# EAGLE design reloj6 (EAGLE 7.6.0)
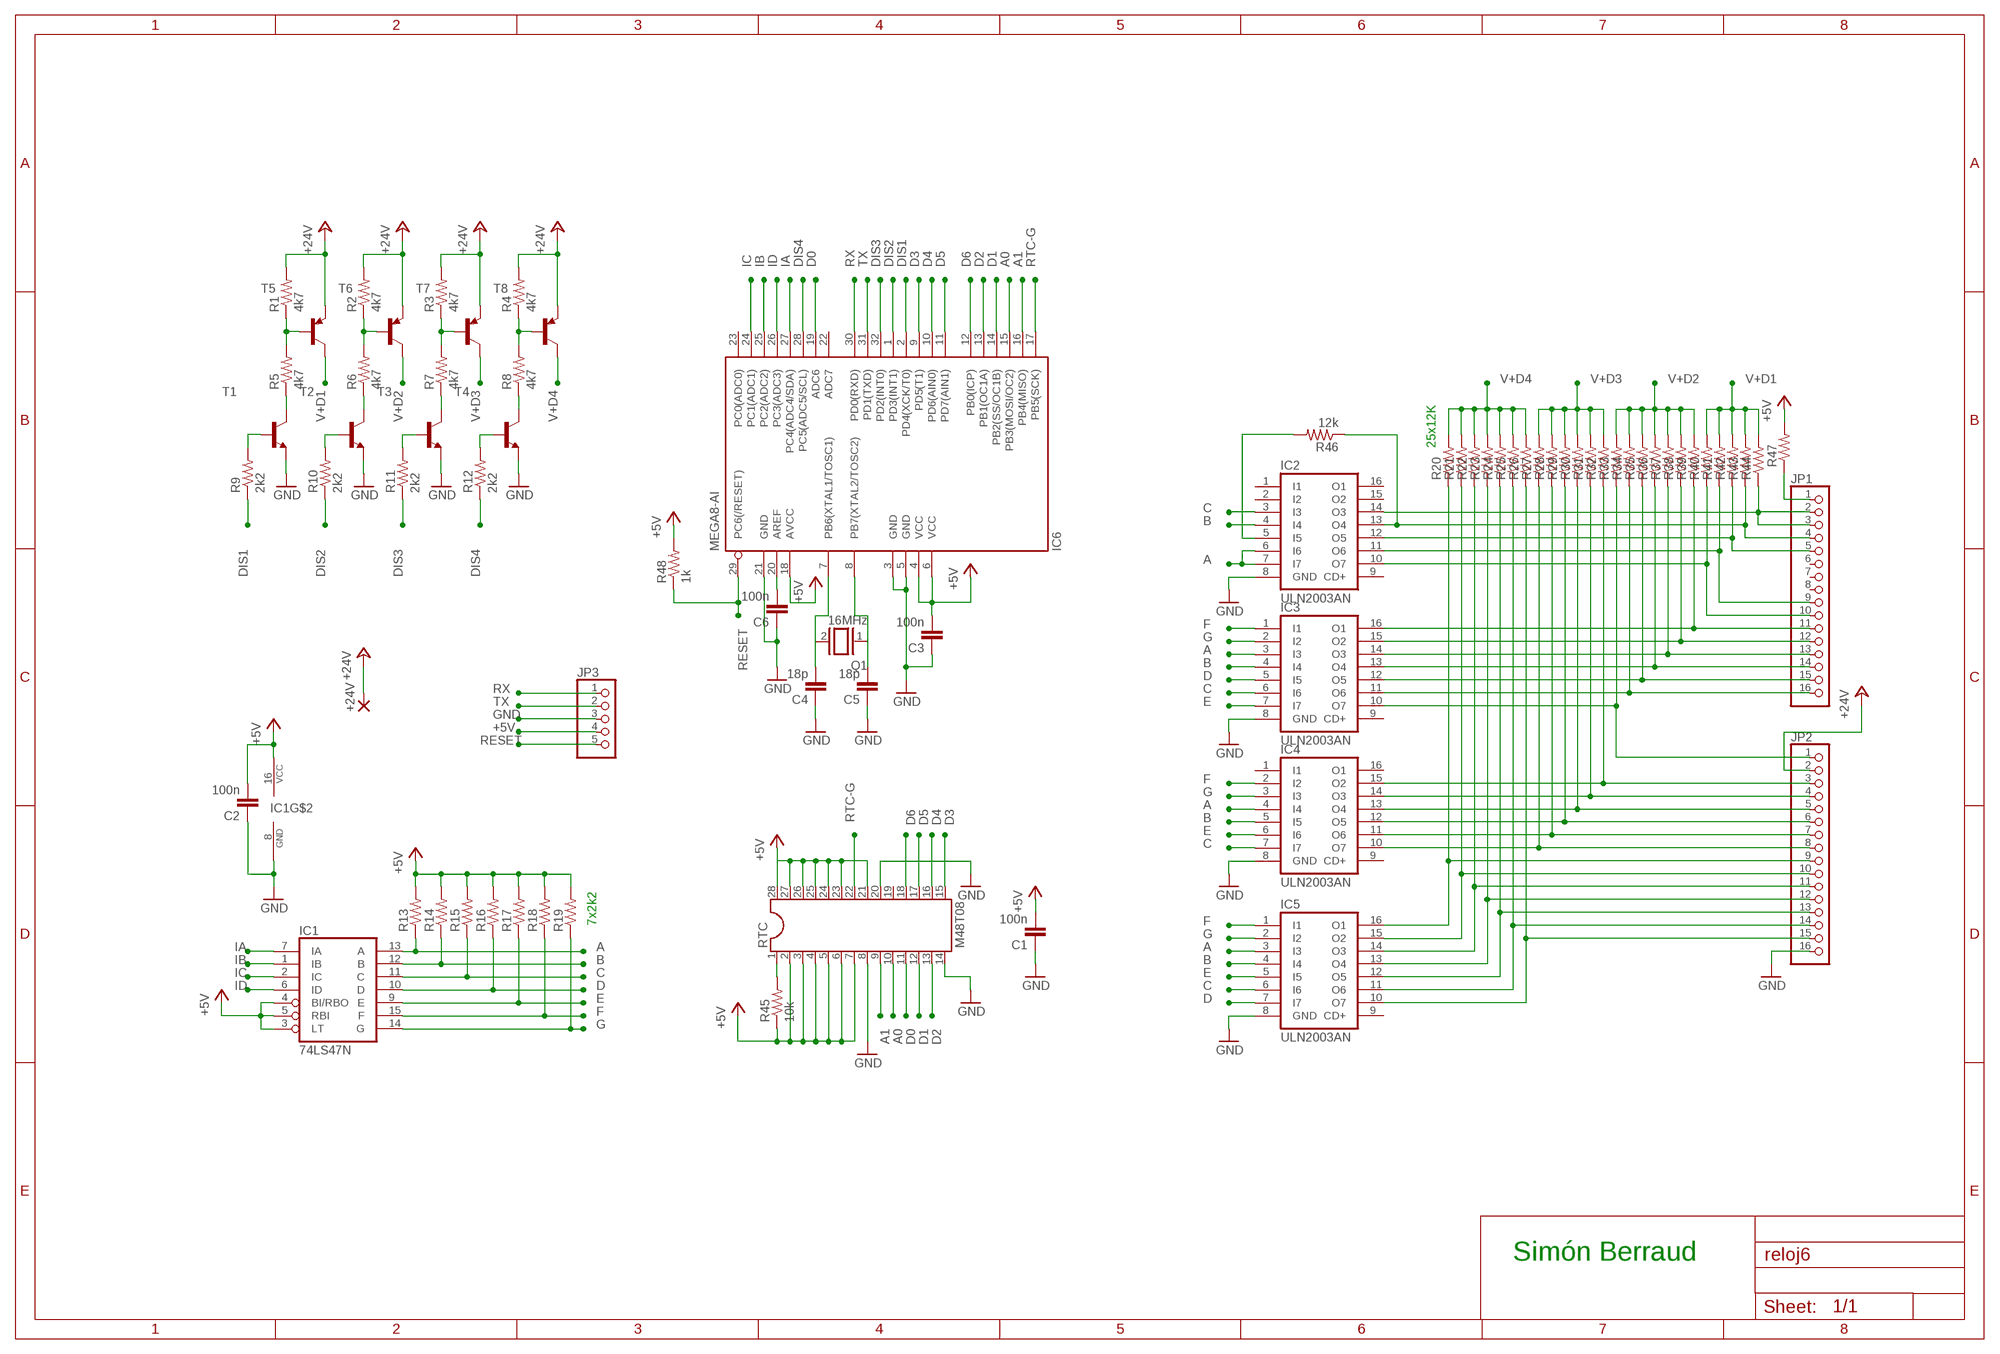
[diagram p0: schematic, sheet 1]

## Parts
+24V  2,54/0,8  [2,54/0,8]
C1  100n  C-EU025-025X050  [C025-025X050]
C2  100n  C-EU025-025X050  [C025-025X050]
C3  100n  C-EU025-025X050  [C025-025X050]
C4  18p  C-EUC0805K  [C0805K]
C5  18p  C-EUC0805K  [C0805K]
C6  100n  C-EUC0805K  [C0805K]
IC1  74LS47N  [DIL16]
IC2  ULN2003AN  [DIL16]
IC3  ULN2003AN  [DIL16]
IC4  ULN2003AN  [DIL16]
IC5  ULN2003AN  [DIL16]
IC6  MEGA8-AI  [TQFP32-08]
JP1  PINHD-1X16  [1X16]
JP2  PINHD-1X16  [1X16]
JP3  PINHD-1X5  [1X05]
Q1  16MHz  XTAL/S  [QS]
R1  4k7  R-US_0207/7  [0207/7]
R2  4k7  R-US_0207/7  [0207/7]
R3  4k7  R-US_0207/7  [0207/7]
R4  4k7  R-US_0207/7  [0207/7]
R5  4k7  R-US_0207/7  [0207/7]
R6  4k7  R-US_0207/7  [0207/7]
R7  4k7  R-US_0207/7  [0207/7]
R8  4k7  R-US_0207/7  [0207/7]
R9  2k2  R-US_0207/7  [0207/7]
R10  2k2  R-US_0207/7  [0207/7]
R11  2k2  R-US_0207/7  [0207/7]
R12  2k2  R-US_0207/7  [0207/7]
R13  R-US_0207/7  [0207/7]
R14  R-US_0207/7  [0207/7]
R15  R-US_0207/7  [0207/7]
R16  R-US_0207/7  [0207/7]
R17  R-US_0207/7  [0207/7]
R18  R-US_0207/7  [0207/7]
R19  R-US_0207/7  [0207/7]
R20  R-US_0207/7  [0207/7]
R21  R-US_0207/7  [0207/7]
R22  R-US_0207/7  [0207/7]
R23  R-US_0207/7  [0207/7]
R24  R-US_0207/7  [0207/7]
R25  R-US_0207/7  [0207/7]
R26  R-US_0207/7  [0207/7]
R27  R-US_0207/7  [0207/7]
R28  R-US_0207/7  [0207/7]
R29  R-US_0207/7  [0207/7]
R30  R-US_0207/7  [0207/7]
R31  R-US_0207/7  [0207/7]
R32  R-US_0207/7  [0207/7]
R33  R-US_0207/7  [0207/7]
R34  R-US_0207/7  [0207/7]
R35  R-US_0207/7  [0207/7]
R36  R-US_0207/7  [0207/7]
R37  R-US_0207/7  [0207/7]
R38  R-US_0207/7  [0207/7]
R39  R-US_0207/7  [0207/7]
R40  R-US_0207/7  [0207/7]
R41  R-US_0207/7  [0207/7]
R42  R-US_0207/7  [0207/7]
R43  R-US_0207/7  [0207/7]
R44  R-US_0207/7  [0207/7]
R45  10k  R-US_0207/7  [0207/7]
R46  12k  R-US_0207/7  [0207/7]
R47  R-US_0411/12  [0411/12]
R48  1k  R-US_R1206  [R1206]
RTC  M48T08  DIL28  [DIL28-6]
T1  BC169-NPN-TO92-ECB  [TO92-ECB]
T2  BC169-NPN-TO92-ECB  [TO92-ECB]
T3  BC169-NPN-TO92-ECB  [TO92-ECB]
T4  BC169-NPN-TO92-ECB  [TO92-ECB]
T5  -PNP-TO92-ECB  [TO92-ECB]
T6  -PNP-TO92-ECB  [TO92-ECB]
T7  -PNP-TO92-ECB  [TO92-ECB]
T8  -PNP-TO92-ECB  [TO92-ECB]

## Nets
+5V: C1.2 C2.2 C3.2 IC1.3(LT) IC1.4(BI/RBO) IC1.5(RBI) IC1.16(VCC) IC6.4(VCC) IC6.6(VCC) IC6.18(AVCC) JP3.4 R13.2 R14.2 R15.2 R16.2 R17.2 R18.2 R19.2 R45.1 R47.2 R48.2 RTC.2 RTC.3 RTC.4 RTC.5 RTC.6 RTC.7 RTC.21 RTC.23 RTC.24 RTC.25 RTC.26 RTC.27 RTC.28
+24V: +24V.1(P) JP2.2 R1.2 R2.2 R3.2 R4.2 T5.E T6.E T7.E T8.E
A: IC1.13(A) IC2.6(I6) IC2.7(I7) IC3.3(I3) IC4.4(I4) IC5.3(I3) R13.1
A0: IC6.15(PB3(MOSI/OC2)) RTC.10
A1: IC6.16(PB4(MISO)) RTC.9
B: IC1.12(B) IC2.4(I4) IC3.4(I4) IC4.5(I5) IC5.4(I4) R14.1
C: IC1.11(C) IC2.3(I3) IC3.6(I6) IC4.7(I7) IC5.6(I6) R15.1
D: IC1.10(D) IC3.5(I5) IC5.7(I7) R16.1
D0: IC6.19(ADC6) RTC.11
D1: IC6.14(PB2(SS/OC1B)) RTC.12
D2: IC6.13(PB1(OC1A)) RTC.13
D3: IC6.9(PD5(T1)) RTC.15
D4: IC6.10(PD6(AIN0)) RTC.16
D5: IC6.11(PD7(AIN1)) RTC.17
D6: IC6.12(PB0(ICP)) RTC.18
DIS1: IC6.2(PD4(XCK/T0)) R9.1
DIS2: IC6.1(PD3(INT1)) R10.1
DIS3: IC6.32(PD2(INT0)) R11.1
DIS4: IC6.28(PC5(ADC5/SCL)) R12.1
E: IC1.9(E) IC3.7(I7) IC4.6(I6) IC5.5(I5) R17.1
F: IC1.15(F) IC3.1(I1) IC4.2(I2) IC5.1(I1) R18.1
G: IC1.14(G) IC3.2(I2) IC4.3(I3) IC5.2(I2) R19.1
GND: C1.1 C2.1 C3.1 C4.1 C5.1 C6.1 IC1.8(GND) IC2.8(GND) IC3.8(GND) IC4.8(GND) IC5.8(GND) IC6.3(GND) IC6.5(GND) IC6.21(GND) JP2.16 JP3.3 RTC.8 RTC.14 RTC.20 T1.E T2.E T3.E T4.E
IA: IC1.7(IA) IC6.27(PC4(ADC4/SDA))
IB: IC1.1(IB) IC6.25(PC2(ADC2))
IC: IC1.2(IC) IC6.24(PC1(ADC1))
ID: IC1.6(ID) IC6.26(PC3(ADC3))
N$1: R9.2 T1.B
N$2: R10.2 T2.B
N$3: R11.2 T3.B
N$4: R12.2 T4.B
N$5: JP1.1 R47.1
N$6: R1.1 R5.2 T5.B
N$7: R2.1 R6.2 T6.B
N$8: R3.1 R7.2 T7.B
N$9: R4.1 R8.2 T8.B
N$10: R5.1 T1.C
N$11: R6.1 T2.C
N$12: R45.2 RTC.1
N$13: R7.1 T3.C
N$14: R8.1 T4.C
N$15: C4.2 IC6.7(PB6(XTAL1/TOSC1)) Q1.2
N$16: IC5.16(O1) JP2.9 R20.1
N$17: C5.2 IC6.8(PB7(XTAL2/TOSC2)) Q1.1
N$18: C6.2 IC6.20(AREF)
N$24: IC3.13(O4) JP1.14 R36.1
N$26: IC3.11(O6) JP1.16 R34.1
N$29: IC4.14(O3) JP2.4 R31.1
N$31: IC4.12(O5) JP2.6 R29.1
N$32: IC4.11(O6) JP2.7 R28.1
N$37: IC2.13(O4) JP1.4 R43.1 R46.1
N$38: IC2.5(I5) R46.2
N$39: IC2.10(O7) JP1.10 R40.1
N$40: IC2.11(O6) JP1.9 R41.1
N$41: IC2.12(O5) JP1.5 R42.1
N$42: IC2.14(O3) JP1.2 JP1.3 R44.1
N$43: IC3.16(O1) JP1.11 R39.1
N$44: IC3.15(O2) JP1.12 R38.1
N$45: IC3.14(O3) JP1.13 R37.1
N$47: IC3.12(O5) JP1.15 R35.1
N$49: IC3.10(O7) JP2.1 R33.1
N$50: IC4.15(O2) JP2.3 R32.1
N$52: IC4.13(O4) JP2.5 R30.1
N$55: IC4.10(O7) JP2.8 R27.1
N$57: IC5.15(O2) JP2.10 R21.1
N$58: IC5.14(O3) JP2.11 R22.1
N$59: IC5.13(O4) JP2.12 R23.1
N$60: IC5.12(O5) JP2.13 R24.1
N$61: IC5.11(O6) JP2.14 R25.1
N$62: IC5.10(O7) JP2.15 R26.1
RESET: IC6.29(PC6(/RESET)) JP3.5 R48.1
RTC-G: IC6.17(PB5(SCK)) RTC.22
RX: IC6.30(PD0(RXD)) JP3.1
TX: IC6.31(PD1(TXD)) JP3.2
V+D1: R40.2 R41.2 R42.2 R43.2 R44.2 T5.C
V+D2: R33.2 R34.2 R35.2 R36.2 R37.2 R38.2 R39.2 T6.C
V+D3: R27.2 R28.2 R29.2 R30.2 R31.2 R32.2 T7.C
V+D4: R20.2 R21.2 R22.2 R23.2 R24.2 R25.2 R26.2 T8.C
Unconnected: IC2.1(I1) IC2.2(I2) IC2.9(CD+) IC2.15(O2) IC2.16(O1) IC3.9(CD+) IC4.1(I1) IC4.9(CD+) IC4.16(O1) IC5.9(CD+) IC6.22(ADC7) IC6.23(PC0(ADC0)) JP1.6 JP1.7 JP1.8 RTC.19

## Notes on the sheet
- 25x12K
- 7x2k2
- Simón Berraud

## Library data of the parts
+24V = wirepad:2,54/0,8: THROUGH-HOLE PAD
C1-C3 = rcl:C-EU: CAPACITOR, European symbol
C4-C6 = resistor:C-EU: CAPACITOR, European symbol
IC1 = 74xx-us:74*47: BCD to seven segment DECODER/DRIVER Source: http://www.ee.washington.edu/stores/DataSheets/74ls/74ls47.pdf
IC2-IC5 = uln-udn:ULN2003A: DRIVER ARRAY
IC6 = atmel:MEGA8: MICROCONTROLLER 8 Kbytes FLASH, 1 kbytes SRAM, 512 bytes EEPROM, USART, 6-channel 10 bit ADC, 2-channel 8 bit ADC Pin compatible with Atmega48, ATMega88, ATMega168 Source: avr.lbr; MPN: ATMEGA8-16AU; OC_FARNELL: 9171371; OC_NEWARK: 73M8863
JP1 JP2 = pinhead:PINHD-1X16: PIN HEADER
JP3 = pinhead:PINHD-1X5: PIN HEADER
Q1 = special:XTAL/S: CRYSTAL
R1-R48 = rcl:R-US_: RESISTOR, American symbol
RTC = ic-package:DIL28: Dual In Line
T1-T4 = transistor:*-NPN-: NPN Transistror BF959 corrected 2008.03.06
T5-T8 = transistor-neu-to92:*-PNP-: PNP Transistror

## Board
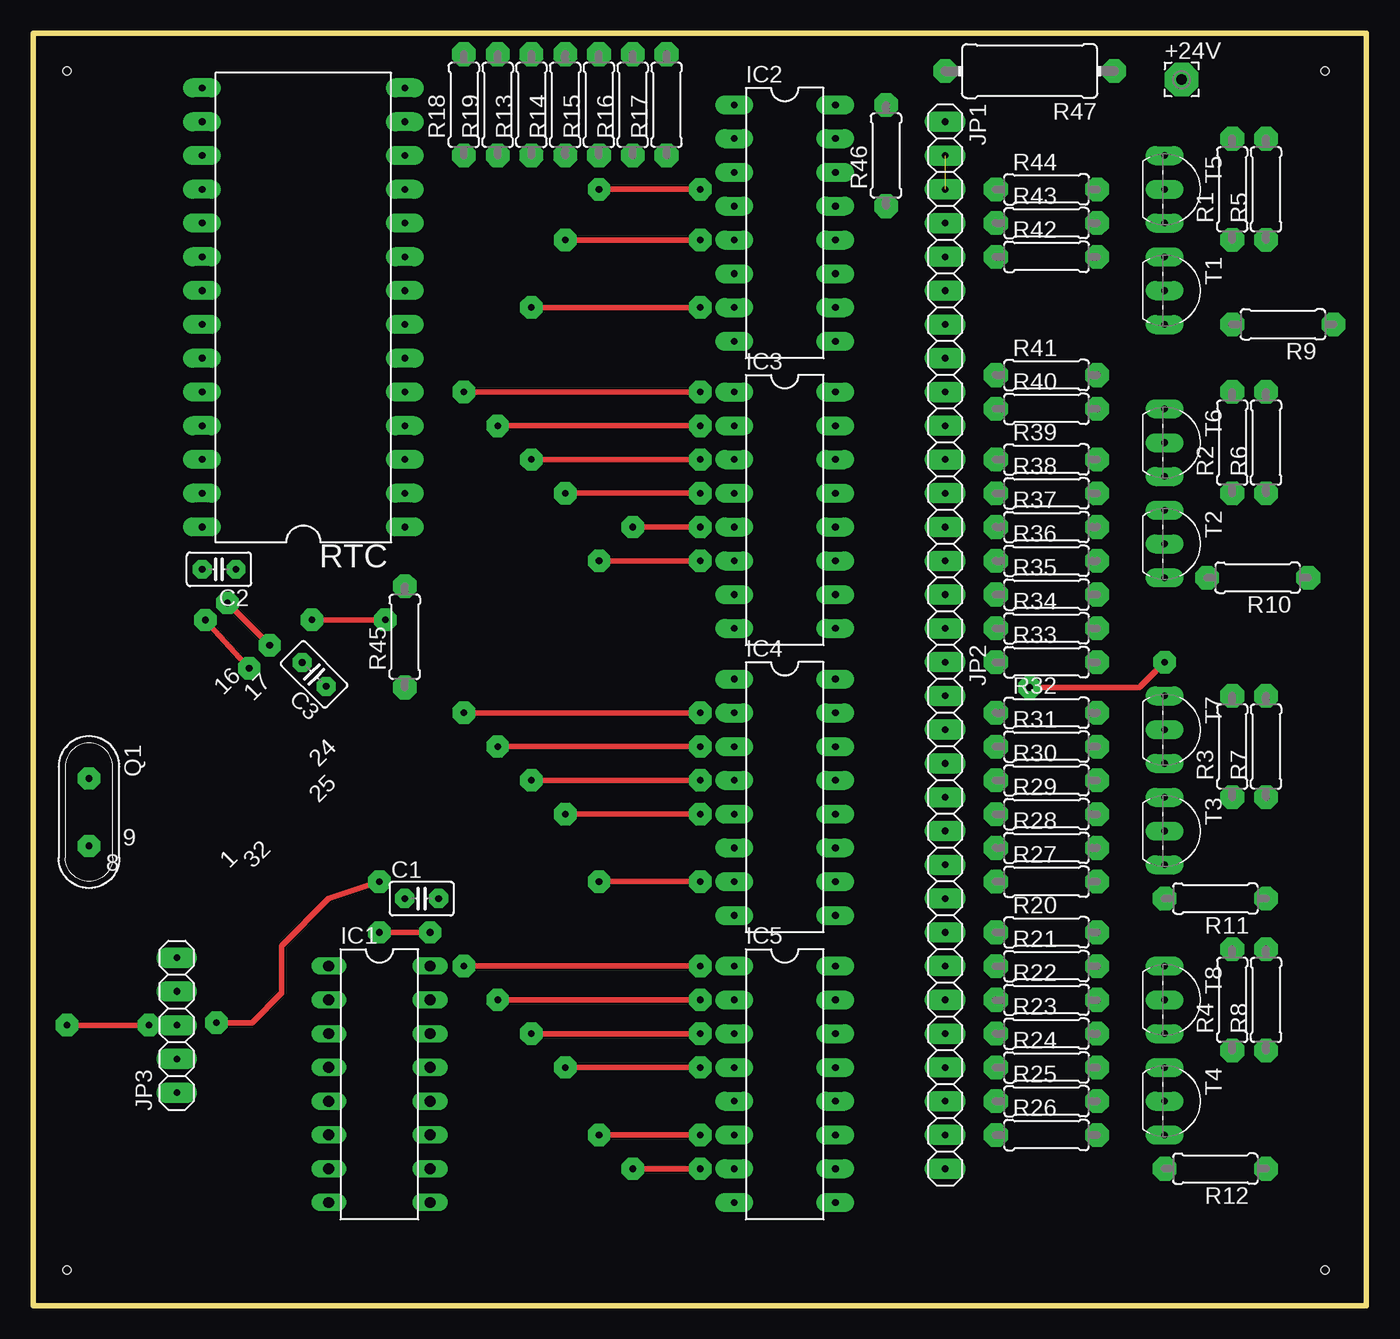
[diagram p1: board, top side]
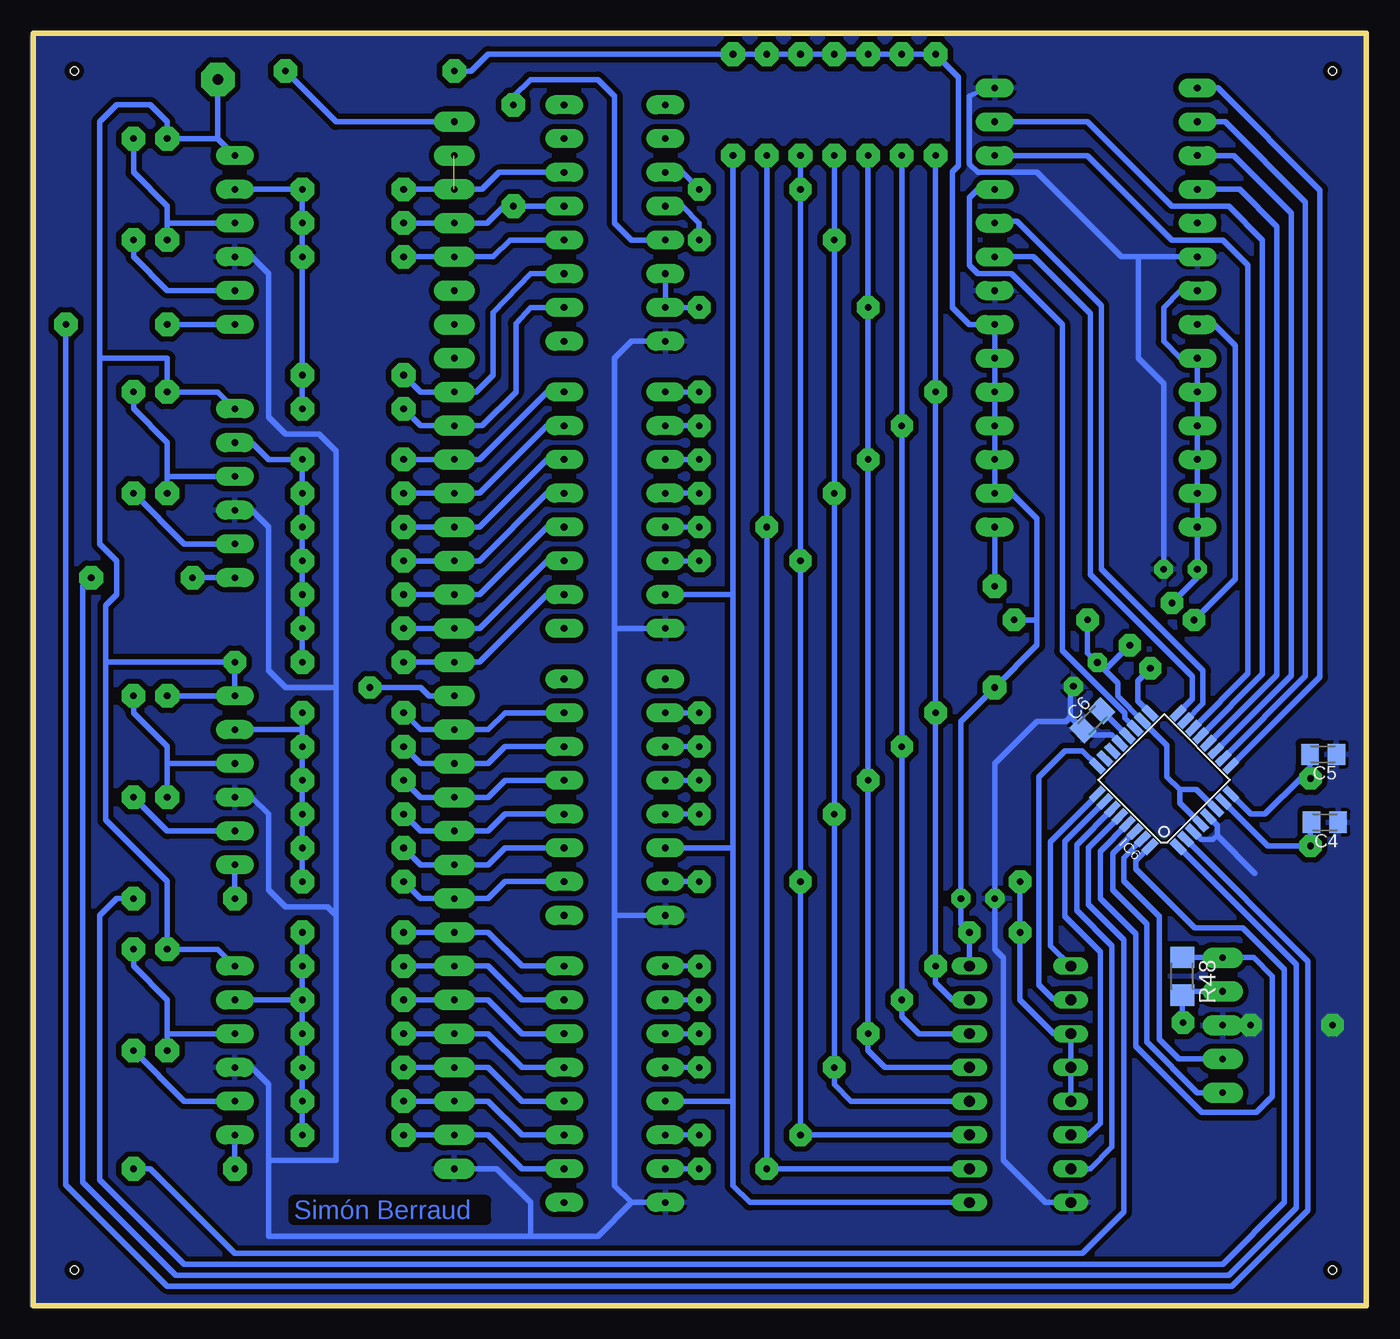
[diagram p2: board, bottom side, seen from below]

Size 100.25 x 95.68 mm. Coordinates in mm from the lower left corner, seen from the top.
Outline: 0,0 100.25,0 100.25,95.68 0,95.68 0,0
Copper layers (1*16): Top 0.035mm / dielectric 1.5mm / Bottom 0.035mm
Design rules "default *": minimum track width 10mil, minimum drill 24mil, track to track 8mil, track to pad 8mil, pad to pad 8mil, via to via 8mil, smd to smd 8mil, copper to edge 0mil, drill to drill 8mil, minimum pad ring 10mil, minimum via ring 8mil, stop-mask expansion 4mil, vias tented up to drill 0mil, thermal gap 10mil
Holes 0.6 mm at 2.54,92.84 97.16,92.84 2.54,2.67 97.16,2.67

### Footprints (pad centres in the part's own frame; a part is rotated, then mirrored left to right if it is on the bottom)
2,54/0,8 = drill 0.813 pad 2.54 octagon: 1 0,0
C025-025X050 = drill 0.5 pad 1.422 octagon: 1 -1.27,0; 2 1.27,0
C0805K = smd 1.3 x 1.6: 1 -1,0; 2 1,0
DIL16 = drill 0.813 long: 1 -8.89,-3.81; 2 -6.35,-3.81; 3 -3.81,-3.81; 4 -1.27,-3.81; 5 1.27,-3.81; 6 3.81,-3.81; 7 6.35,-3.81; 8 8.89,-3.81; 9 8.89,3.81; 10 6.35,3.81; 11 3.81,3.81; 12 1.27,3.81; 13 -1.27,3.81; 14 -3.81,3.81; 15 -6.35,3.81; 16 -8.89,3.81
DIL16' = drill 0.5 pad 1.422 long: 1 -8.89,-3.81; 2 -6.35,-3.81; 3 -3.81,-3.81; 4 -1.27,-3.81; 5 1.27,-3.81; 6 3.81,-3.81; 7 6.35,-3.81; 8 8.89,-3.81; 9 8.89,3.81; 10 6.35,3.81; 11 3.81,3.81; 12 1.27,3.81; 13 -1.27,3.81; 14 -3.81,3.81; 15 -6.35,3.81; 16 -8.89,3.81
TQFP32-08 = smd 1.27 x 0.559: 1 -4.293,2.8; 2 -4.293,2; 3 -4.293,1.2; 4 -4.293,0.4; 5 -4.293,-0.4; 6 -4.293,-1.2; 7 -4.293,-2; 8 -4.293,-2.8; 17 4.293,-2.8; 18 4.293,-2; 19 4.293,-1.2; 20 4.293,-0.4; 21 4.293,0.4; 22 4.293,1.2; 23 4.293,2; 24 4.293,2.8 | smd 0.559 x 1.27: 9 -2.8,-4.293; 10 -2,-4.293; 11 -1.2,-4.293; 12 -0.4,-4.293; 13 0.4,-4.293; 14 1.2,-4.293; 15 2,-4.293; 16 2.8,-4.293; 25 2.8,4.293; 26 2,4.293; 27 1.2,4.293; 28 0.4,4.293; 29 -0.4,4.293; 30 -1.2,4.293; 31 -2,4.293; 32 -2.8,4.293
1X16 = drill 0.5 pad 1.524 long: 1 -19.05,0; 2 -16.51,0; 3 -13.97,0; 4 -11.43,0; 5 -8.89,0; 6 -6.35,0; 7 -3.81,0; 8 -1.27,0; 9 1.27,0; 10 3.81,0; 11 6.35,0; 12 8.89,0; 13 11.43,0; 14 13.97,0; 15 16.51,0; 16 19.05,0
1X05 = drill 0.5 pad 1.524 long: 1 -5.08,0; 2 -2.54,0; 3 0,0; 4 2.54,0; 5 5.08,0
QS = drill 0.5 pad 1.676 octagon: 1 -2.54,0; 2 2.54,0
0207/7 = drill 0.5 pad 1.778 octagon: 1 -3.81,0; 2 3.81,0
0411/12 = drill 0.5 pad 1.778 octagon: 1 -6.35,0; 2 6.35,0
R1206 = smd 1.6 x 1.803: 1 -1.422,0; 2 1.422,0
DIL28-6 = drill 0.5 pad 1.422 long: 1 -16.51,-7.62; 2 -13.97,-7.62; 3 -11.43,-7.62; 4 -8.89,-7.62; 5 -6.35,-7.62; 6 -3.81,-7.62; 7 -1.27,-7.62; 8 1.27,-7.62; 9 3.81,-7.62; 10 6.35,-7.62; 11 8.89,-7.62; 12 11.43,-7.62; 13 13.97,-7.62; 14 16.51,-7.62; 15 16.51,7.62; 16 13.97,7.62; 17 11.43,7.62; 18 8.89,7.62; 19 6.35,7.62; 20 3.81,7.62; 21 1.27,7.62; 22 -1.27,7.62; 23 -3.81,7.62; 24 -6.35,7.62; 25 -8.89,7.62; 26 -11.43,7.62; 27 -13.97,7.62; 28 -16.51,7.62
TO92-ECB = drill 0.5 pad 1.422 long: B 2.54,0; C 0,0; E -2.54,0

### Placement (x,y rotation side)
+24V  86.36,92.2 0 top
C1  29.21,30.61 0 top
C2  13.97,55.37 180 top
C3  21.12,47.46 135 top
C4  3.11,36.34 180 bottom
C5  3.24,41.45 180 bottom
C6  20.59,44.02 45 bottom
IC1  26.03,16.64 270 top
IC2  ULN2003AN  [DIL16']  56.52,81.41 270 top
IC3  ULN2003AN  [DIL16']  56.52,59.82 270 top
IC4  ULN2003AN  [DIL16']  56.52,38.23 270 top
IC5  ULN2003AN  [DIL16']  56.52,16.64 270 top
IC6  15.2,39.53 135 bottom
JP1  68.58,69.98 270 top
JP2  68.58,29.34 270 top
JP3  10.79,21.08 90 top
Q1  4.19,37.1 270 top
R1  90.17,83.95 90 top
R2  90.17,64.9 90 top
R3  90.17,42.04 90 top
R4  90.17,22.99 90 top
R5  92.71,83.95 90 top
R6  92.71,64.9 90 top
R7  92.71,42.04 90 top
R8  92.71,22.99 90 top
R9  93.98,73.79 180 top
R10  92.08,54.74 180 top
R11  88.9,30.61 180 top
R12  88.9,10.29 180 top
R13  37.47,90.3 90 top
R14  40,90.3 90 top
R15  42.55,90.3 90 top
R16  45.08,90.3 90 top
R17  47.62,90.3 90 top
R18  32.38,90.3 90 top
R19  34.92,90.3 90 top
R20  76.2,28.07 0 top
R21  76.2,25.53 0 top
R22  76.2,22.99 0 top
R23  76.2,20.45 0 top
R24  76.2,17.91 0 top
R25  76.2,15.37 0 top
R26  76.2,12.83 0 top
R27  76.2,31.88 0 top
R28  76.2,34.42 0 top
R29  76.2,36.96 0 top
R30  76.2,39.5 0 top
R31  76.2,42.04 0 top
R32  76.2,44.58 0 top
R33  76.2,48.39 0 top
R34  76.2,50.93 0 top
R35  76.2,53.47 0 top
R36  76.2,56.01 0 top
R37  76.2,58.55 0 top
R38  76.2,61.09 0 top
R39  76.2,63.63 0 top
R40  76.2,67.44 0 top
R41  76.2,69.98 0 top
R42  76.2,78.87 0 top
R43  76.2,81.41 0 top
R44  76.2,83.95 0 top
R45  27.94,50.29 90 top
R46  64.13,86.49 90 top
R47  74.93,92.84 180 top
R48  13.84,24.77 270 bottom
RTC  20.32,75.06 90 top
T1  85.09,76.33 270 top
T2  85.09,57.28 270 top
T3  85.09,35.69 270 top
T4  85.09,15.37 270 top
T5  85.09,83.95 270 top
T6  85.09,64.9 270 top
T7  85.09,43.31 270 top
T8  85.09,22.99 270 top

### Tracks (layer width: path | path; a pad name or v marks a point on that pad's centre or on a via)
+5V  (via drill 0.5 pad 1.68)
  Top 0.406: v26.03,28.07 v29.84,28.07 | v14.6,52.83 v17.78,49.66 | v20.95,51.56 v26.48,51.56 | v13.78,21.27 16.45,21.27 18.67,23.5 18.67,27.05 22.22,30.61 v26.03,31.88
  Bottom 0.406: IC1.5 IC1.4 IC1.3 23.49,20.45 26.03,22.99 v26.03,28.07 v26.03,31.88 | RTC.21 13.97,76.33 15.24,75.06 15.24,72.52 13.97,71.25 RTC.23 RTC.24 RTC.25 RTC.26 RTC.27 RTC.28 C2.2 12.7,54.74 v14.6,52.83 | IC1.16 v29.84,28.07 30.48,28.7 C1.2 30.48,43.94 R45.1 24.77,49.66 24.77,51.56 | IC6.4 14.04,37.8 14.04,38.81 | IC6.6 12.79,38.81 14.04,38.81 | 14.04,38.81 14.98,39.75 14.98,42.13 IC6.18 18.67,45.82 18.67,46.8 19.65,47.79 | R47.2 67.31,92.84 66.04,94.11 R17.2 R16.2 R15.2 R14.2 R13.2 R19.2 R18.2 30.67,92.39 30.67,85.73 31.11,85.28 31.11,75.06 29.84,73.79 RTC.7 RTC.6 RTC.5 RTC.4 RTC.3 RTC.2 26.67,61.09 24.77,59.18 24.77,51.56 | JP3.4 13.56,23.62 R48.2 13.84,21.34 arc-90 v13.78,21.27 | v20.95,51.56 20.95,49.09 C3.2 19.65,47.79 | v26.48,51.56 24.77,51.56 | v17.78,49.66 19.65,47.79
+24V  (via drill 0.5 pad 1.68)
  Top 0.406: v74.93,46.48 83.19,46.48 v85.09,48.39
  Bottom 0.406: 86.36,87.76 R1.2 90.17,89.03 91.44,90.3 93.98,90.3 95.25,89.03 95.25,71.25 | 86.36,87.76 T5.E | 95.25,71.25 90.17,71.25 R2.2 86.36,68.71 T6.E | T8.E 86.36,26.8 R4.2 90.17,31.88 94.81,36.51 94.81,48.39 | R3.2 T7.E v85.09,48.39 94.81,48.39 | JP2.2 70.48,45.85 71.12,46.48 v74.93,46.48 | +24V.1 86.36,87.76 | 94.81,48.39 94.81,52.64 93.98,53.47 93.98,56.01 95.25,57.28 95.25,71.25
A  (via drill 0.5 pad 1.68)
  Top 0.406: v50.16,20.45 v37.47,20.45 | v50.16,39.5 v37.47,39.5 | v50.16,75.06 v37.47,75.06 | v50.16,63.63 v37.47,63.63
  Bottom 0.406: IC1.13 36.19,17.91 37.47,19.18 v37.47,20.45 v37.47,39.5 v37.47,63.63 v37.47,75.06 R13.1 | IC5.3 v50.16,20.45 | IC4.4 v50.16,39.5 | IC2.6 IC2.7 v50.16,75.06 | IC3.3 v50.16,63.63
A0
  Bottom 0.406: IC6.15 12.28,45.28 12.28,47.74 19.94,55.4 19.94,75.18 26.29,81.53 27.81,81.53 RTC.10
A1
  Bottom 0.406: IC6.16 13.09,45.6 13.09,47.3 20.77,54.98 20.77,74.61 25.02,78.87 RTC.9
B  (via drill 0.5 pad 1.68)
  Top 0.406: v50.16,17.91 v40,17.91 | v50.16,36.96 v40,36.96 | v50.16,80.14 v40,80.14 | v50.16,61.09 v40,61.09
  Bottom 0.406: IC1.12 38.73,15.37 40,16.64 v40,17.91 v40,36.96 v40,61.09 v40,80.14 R14.1 | IC5.4 v50.16,17.91 | IC4.5 v50.16,36.96 | IC2.4 51.44,82.68 50.16,81.41 v50.16,80.14 | IC3.4 v50.16,61.09
C  (via drill 0.5 pad 1.68)
  Top 0.406: v50.16,12.83 v42.55,12.83 | v50.16,31.88 v42.55,31.88 | v50.16,56.01 v42.55,56.01 | v50.16,83.95 v42.55,83.95
  Bottom 0.406: IC1.11 v42.55,12.83 v42.55,31.88 v42.55,56.01 v42.55,83.95 R15.1 | IC5.6 v50.16,12.83 | IC4.7 v50.16,31.88 | IC3.6 v50.16,56.01 | IC2.3 51.44,85.22 v50.16,83.95
D  (via drill 0.5 pad 1.68)
  Top 0.406: v50.16,10.29 v45.08,10.29 | v50.16,58.55 v45.08,58.55
  Bottom 0.406: IC1.10 v45.08,10.29 v45.08,58.55 R16.1 | IC5.7 v50.16,10.29 | IC3.5 v50.16,58.55
D0
  Bottom 0.406: RTC.11 29.21,83.95 29.84,83.31 29.84,78.23 29.21,77.6 26.67,77.6 22.86,73.79 22.86,49.25 18.17,44.56 18.17,44.19 IC6.19
D1
  Bottom 0.406: RTC.12 20.95,86.49 14.6,80.14 10.79,80.14 8.89,78.23 8.89,47.54 IC6.14
D2
  Bottom 0.406: RTC.13 20.95,89.03 14.6,82.68 10.35,82.68 7.81,80.14 7.81,47.49 IC6.13
D3
  Bottom 0.406: RTC.15 11.18,91.57 3.49,83.88 3.49,47.28 IC6.9
D4
  Bottom 0.406: RTC.16 10.6,89.03 4.57,82.99 4.57,47.33 IC6.10
D5
  Bottom 0.406: RTC.17 9.97,86.49 5.65,82.17 5.65,47.38 IC6.11
D6
  Bottom 0.406: RTC.18 9.52,83.95 6.73,81.15 6.73,47.44 IC6.12
DIS1
  Bottom 0.406: R9.1 97.79,9.08 90.17,1.46 10.1,1.46 4.38,7.18 4.38,25.88 IC6.2
DIS2
  Bottom 0.406: R10.1 96.52,54.1 96.52,9.27 89.53,2.29 10.35,2.29 5.27,7.37 5.27,25.64 IC6.1
DIS3
  Bottom 0.406: R11.1 93.98,30.61 95.25,29.34 95.25,9.46 88.9,3.11 10.79,3.11 6.16,7.75 6.16,25.27 9.27,28.38 12.89,28.38 17.34,32.83 17.34,33.44 IC6.32
DIS4
  Bottom 0.406: R12.1 91.44,10.29 85.09,3.94 21.59,3.94 21.34,3.94 18.22,7.05 18.22,27.5 20.89,30.16 20.89,34.41 IC6.28
E
  Bottom 0.406: IC1.9 46.36,7.75 47.62,9.02 47.62,15.37 | 47.62,15.37 47.62,34.42 | 47.62,34.42 47.62,53.47 | 47.62,53.47 IC3.7 | IC5.5 47.62,15.37 | IC4.6 47.62,34.42 | 47.62,53.47 R17.1
F  (via drill 0.5 pad 1.68)
  Top 0.406: v50.16,25.53 v32.38,25.53 | v50.16,68.71 v32.38,68.71 | v50.16,44.58 v32.38,44.58
  Bottom 0.406: IC1.15 31.11,22.99 32.38,24.26 v32.38,25.53 v32.38,44.58 v32.38,68.71 R18.1 | IC5.1 v50.16,25.53 | IC3.1 v50.16,68.71 | IC4.2 v50.16,44.58
G  (via drill 0.5 pad 1.68)
  Top 0.406: v50.16,22.99 v34.92,22.99 | v50.16,42.04 v34.92,42.04 | v50.16,66.17 v34.92,66.17
  Bottom 0.406: IC1.14 33.66,20.45 34.92,21.72 v34.92,22.99 v34.92,42.04 v34.92,66.17 R19.1 | IC5.2 v50.16,22.99 | IC4.3 v50.16,42.04 | IC3.2 v50.16,66.17
GND  (via drill 0.5 pad 1.68)
  Top 0.406: v8.7,21.08 v2.54,21.08
  Bottom 0.406: T1.E 83.82,78.87 82.55,77.6 82.55,66.8 81.28,65.53 78.74,65.53 77.47,64.26 77.47,46.48 | IC5.8 55.25,7.75 | 55.25,7.75 56.52,9.02 56.52,29.34 | 56.52,29.34 56.52,50.93 | 56.52,50.93 56.52,71.25 55.25,72.52 IC2.8 | IC3.8 56.52,50.93 | IC4.8 56.52,29.34 | T4.E 83.82,17.91 82.55,16.64 82.55,10.92 | 82.55,10.92 82.55,5.21 62.86,5.21 | 62.86,5.21 57.78,5.21 55.25,7.75 | 77.47,46.48 77.47,29.34 | T3.E 83.82,38.23 82.55,36.96 82.55,31.24 81.28,29.97 78.11,29.97 77.47,29.34 | T2.E 83.82,59.82 82.55,58.55 82.55,47.75 81.28,46.48 77.47,46.48 | IC6.5 11.21,36.1 11.21,35.35 | IC6.3 12.41,35.04 11.52,35.04 11.21,35.35 | 2.03,36.42 C4.1 | IC1.8 24.13,7.75 27.3,10.92 27.3,26.16 27.94,26.8 C1.1 27.94,40.77 24.77,43.94 22.58,43.94 22.25,44.27 | IC6.21 19.14,42.9 20.64,42.9 21.05,43.31 C6.1 22.25,44.27 | RTC.20 17.14,78.87 | 17.14,78.87 18.41,78.87 24.77,85.22 29.21,85.22 29.84,85.85 29.84,90.93 28.58,91.57 RTC.14 | C2.1 15.24,69.34 17.14,71.25 17.14,78.87 | C3.1 22.25,46.33 22.25,44.27 | 11.21,35.35 8.36,32.51 | JP3.3 v8.7,21.08 | v2.54,21.08 1.91,21.08 | 77.47,29.34 77.47,10.92 82.55,10.92 | JP2.16 65.41,10.29 62.86,7.75 62.86,5.21
  pour Bottom (isolate 0.406): 0,95.38 0,0 100.33,0 100.33,95.38
IA
  Bottom 0.406: IC6.27 21.78,34.65 21.78,29.72 19.11,27.05 19.11,11.94 20.77,10.29 IC1.7
IB
  Bottom 0.406: IC6.25 20.22,38.39 23.75,34.86 23.75,27.05 IC1.1
IC
  Bottom 0.406: IC6.24 20.22,40.6 21.34,41.72 22.67,41.72 24.64,39.75 24.64,24.13 23.56,23.05 22.29,23.05 IC1.2
ID
  Bottom 0.406: IC6.26 22.67,34.89 22.67,29.27 20,26.61 20,13.72 20.89,12.83 IC1.6
N$1
  Bottom 0.406: T1.B R9.2
N$2
  Bottom 0.406: T2.B R10.2
N$3
  Bottom 0.406: T3.B R11.2
N$4
  Bottom 0.406: T4.B R12.2
N$5
  Bottom 0.406: JP1.1 77.47,89.03 R47.1
N$6
  Bottom 0.406: T5.B 90.17,81.41 | R5.2 92.71,85.22 90.17,82.68 90.17,81.41 | 90.17,81.41 R1.1
N$7
  Bottom 0.406: T6.B 90.17,62.36 | R6.2 92.71,67.44 90.17,64.9 90.17,62.36 | 90.17,62.36 R2.1
N$8
  Bottom 0.406: R7.2 92.71,44.58 90.17,42.04 90.17,40.77 | 90.17,40.77 R3.1 | T7.B 90.17,40.77
N$9
  Bottom 0.406: R8.2 92.71,25.53 90.17,22.99 90.17,20.45 | 90.17,20.45 R4.1 | T8.B 90.17,20.45
N$10
  Bottom 0.406: T1.C 90.17,76.33 92.71,78.87 R5.1
N$11
  Bottom 0.406: T2.C 88.9,57.28 R6.1
N$12
  Bottom 0.406: RTC.1 R45.2
N$13
  Bottom 0.406: T3.C 90.17,35.69 R7.1
N$14
  Bottom 0.406: T4.C 88.9,15.37 R8.1
N$15
  Bottom 0.406: C4.2 4.19,36.26 Q1.2 7.41,34.56 IC6.7
N$16
  Bottom 0.406: R20.1 JP2.9 66.04,28.07 63.5,25.53 IC5.16
N$17
  Bottom 0.406: 4.19,41.53 C5.2 4.24,39.64 Q1.1 4.93,39.64 7.62,36.96 8.67,36.96 IC6.8
N$18
  Bottom 0.406: IC6.20 19.45,44.34 C6.2
N$24
  Bottom 0.406: R36.1 JP1.14 66.67,56.01 61.59,61.09 IC3.13
N$26
  Bottom 0.406: R34.1 JP1.16 66.67,50.93 61.59,56.01 IC3.11
N$29
  Bottom 0.406: R31.1 71.12,40.77 JP2.4 66.04,40.77 64.77,42.04 IC4.14
N$31
  Bottom 0.406: R29.1 71.12,35.69 JP2.6 66.04,35.69 64.77,36.96 IC4.12
N$32
  Bottom 0.406: R28.1 71.12,33.15 JP2.7 66.04,33.15 64.77,34.42 IC4.11
N$37
  Bottom 0.406: R43.1 JP1.4 66.1,81.41 64.83,82.68 R46.1 IC2.13
N$38
  Bottom 0.406: R46.2 64.13,90.93 62.86,92.2 57.78,92.2 56.52,90.93 56.52,81.41 55.25,80.14 IC2.5
N$39
  Bottom 0.406: R40.1 71.12,66.17 JP1.10 66.48,66.17 63.94,68.71 63.94,73.85 62.86,75.06 IC2.10
N$40
  Bottom 0.406: R41.1 71.12,68.71 JP1.9 66.93,68.71 65.66,69.98 65.66,74.68 62.86,77.6 IC2.11
N$41
  Bottom 0.406: R42.1 JP1.5 65.66,78.87 64.39,80.14 IC2.12
N$42  (1 unrouted)
  Bottom 0.406: R44.1 JP1.3 66.48,83.95 65.22,85.22 IC2.14
N$43
  Bottom 0.406: R39.1 JP1.11 66.67,63.63 61.59,68.71 IC3.16
N$44
  Bottom 0.406: R38.1 JP1.12 66.67,61.09 61.59,66.17 IC3.15
N$45
  Bottom 0.406: R37.1 JP1.13 66.67,58.55 61.59,63.63 IC3.14
N$47
  Bottom 0.406: R35.1 JP1.15 66.67,53.47 61.59,58.55 IC3.12
N$49
  Bottom 0.406: R33.1 JP2.1 66.67,48.39 61.59,53.47 IC3.10
N$50
  Bottom 0.406: R32.1 71.12,43.31 JP2.3 66.04,43.31 64.77,44.58 IC4.15
N$52
  Bottom 0.406: R30.1 71.12,38.23 JP2.5 66.04,38.23 64.77,39.5 IC4.13
N$55
  Bottom 0.406: R27.1 71.12,30.61 JP2.8 66.04,30.61 64.77,31.88 IC4.10
N$57
  Bottom 0.406: R21.1 JP2.10 66.04,25.53 63.5,22.99 IC5.15
N$58
  Bottom 0.406: R22.1 JP2.11 66.04,22.99 63.5,20.45 IC5.14
N$59
  Bottom 0.406: R23.1 JP2.12 66.04,20.45 63.5,17.91 IC5.13
N$60
  Bottom 0.406: R24.1 JP2.13 66.04,17.91 63.5,15.37 IC5.12
N$61
  Bottom 0.406: R25.1 JP2.14 66.04,15.37 63.5,12.83 IC5.11
N$62
  Bottom 0.406: R26.1 JP2.15 66.04,12.83 63.5,10.29 IC5.10
RESET
  Bottom 0.406: IC6.29 20,34.16 20,30.61 17.34,27.94 17.34,19.5 12.38,14.54 8.25,14.54 7.05,15.75 7.05,24.77 8.47,26.19 10.79,26.19 | R48.1 10.79,26.19 | JP3.5 10.79,26.19
RTC-G  (via drill 0.5 pad 1.68)
  Top 0.406: v16.24,47.93 v12.94,51.55
  Bottom 0.406: IC6.17 17.18,45.46 17.18,46.98 v16.24,47.93 | RTC.22 11.43,73.79 9.84,72.2 9.84,54.65 v12.94,51.55
RX
  Bottom 0.406: IC6.30 19.05,33.98 19.05,31.24 16.51,28.7 16.51,19.81 12.7,16 JP3.1
TX
  Bottom 0.406: IC6.31 18.22,33.68 18.22,31.94 15.56,29.27 15.56,20 14.1,18.54 JP3.2
V+D1
  Bottom 0.406: R40.2 R41.2 R42.2 R43.2 R44.2 T5.C
V+D2
  Bottom 0.406: R33.2 R34.2 R35.2 R36.2 R37.2 R38.2 R39.2 82.55,63.63 83.82,64.9 T6.C
V+D3
  Bottom 0.406: R27.2 R28.2 R29.2 R30.2 R31.2 80.01,43.31 | 80.01,43.31 R32.2 | T7.C 80.01,43.31
V+D4
  Bottom 0.406: R26.2 R25.2 R24.2 R23.2 R22.2 | R22.2 R21.2 R20.2 | T8.C R22.2

### Text on the board
Bottom: Simón Berraud
tNames: 16 | 17 | 24 | 25 | 9 | 8 | 1 | 32